# EAGLE design breakout v1.1 (EAGLE 7.2.0)
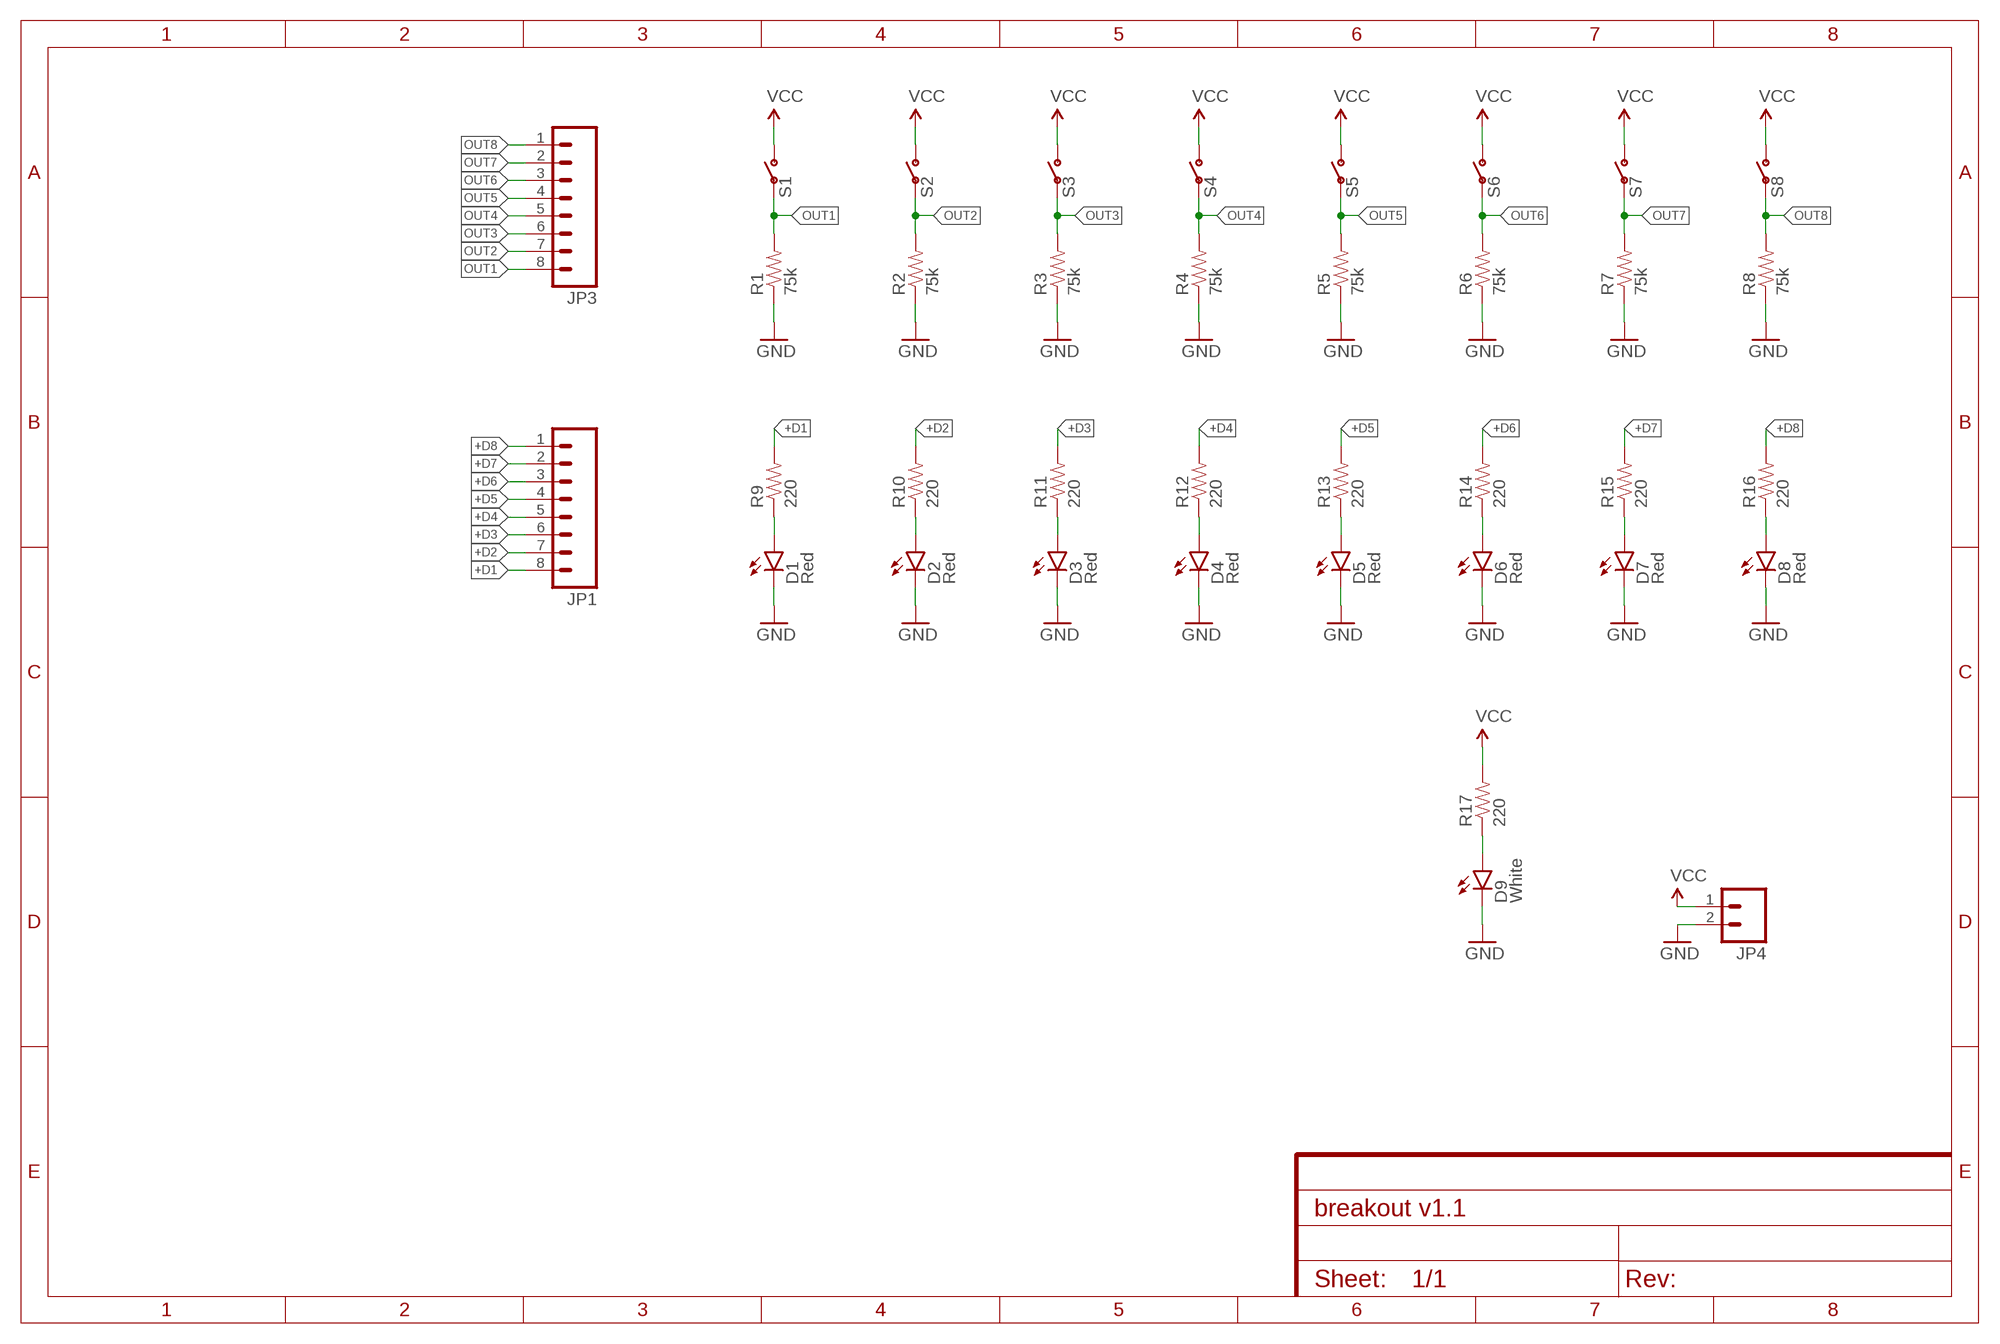
[diagram p0: schematic, sheet 1]

## Parts
D1  Red  LED0805  [0805]
D2  Red  LED0805  [0805]
D3  Red  LED0805  [0805]
D4  Red  LED0805  [0805]
D5  Red  LED0805  [0805]
D6  Red  LED0805  [0805]
D7  Red  LED0805  [0805]
D8  Red  LED0805  [0805]
D9  White  LED0603  [LED-0603]
JP1  M08  [1X08_ROUND]
JP3  M08  [1X08_ROUND]
JP4  M02PTH  [1X02]
R1  75k  RESISTOR0805-RES  [0805]
R2  75k  RESISTOR0805-RES  [0805]
R3  75k  RESISTOR0805-RES  [0805]
R4  75k  RESISTOR0805-RES  [0805]
R5  75k  RESISTOR0805-RES  [0805]
R6  75k  RESISTOR0805-RES  [0805]
R7  75k  RESISTOR0805-RES  [0805]
R8  75k  RESISTOR0805-RES  [0805]
R9  220  RESISTOR0805-RES  [0805]
R10  220  RESISTOR0805-RES  [0805]
R11  220  RESISTOR0805-RES  [0805]
R12  220  RESISTOR0805-RES  [0805]
R13  220  RESISTOR0805-RES  [0805]
R14  220  RESISTOR0805-RES  [0805]
R15  220  RESISTOR0805-RES  [0805]
R16  220  RESISTOR0805-RES  [0805]
R17  220  RESISTOR0805-RES  [0805]
S1  SWITCH_SPSTSMD  [5.2X5.2X1.5-SMD]
S2  SWITCH_SPSTSMD  [5.2X5.2X1.5-SMD]
S3  SWITCH_SPSTSMD  [5.2X5.2X1.5-SMD]
S4  SWITCH_SPSTSMD  [5.2X5.2X1.5-SMD]
S5  SWITCH_SPSTSMD  [5.2X5.2X1.5-SMD]
S6  SWITCH_SPSTSMD  [5.2X5.2X1.5-SMD]
S7  SWITCH_SPSTSMD  [5.2X5.2X1.5-SMD]
S8  SWITCH_SPSTSMD  [5.2X5.2X1.5-SMD]

## Nets
+D1: JP1.8 R9.2
+D2: JP1.7 R10.2
+D3: JP1.6 R11.2
+D4: JP1.5 R12.2
+D5: JP1.4 R13.2
+D6: JP1.3 R14.2
+D7: JP1.2 R15.2
+D8: JP1.1 R16.2
GND: D1.2(C) D2.2(C) D3.2(C) D4.2(C) D5.2(C) D6.2(C) D7.2(C) D8.2(C) D9.C JP4.2 R1.1 R2.1 R3.1 R4.1 R5.1 R6.1 R7.1 R8.1
N$1: D1.1(A) R9.1
N$2: D2.1(A) R10.1
N$3: D3.1(A) R11.1
N$4: D4.1(A) R12.1
N$5: D5.1(A) R13.1
N$6: D6.1(A) R14.1
N$7: D7.1(A) R15.1
N$8: D8.1(A) R16.1
N$9: D9.A R17.1
OUT1: JP3.8 R1.2 S1.P$3
OUT2: JP3.7 R2.2 S2.P$3
OUT3: JP3.6 R3.2 S3.P$3
OUT4: JP3.5 R4.2 S4.P$3
OUT5: JP3.4 R5.2 S5.P$3
OUT6: JP3.3 R6.2 S6.P$3
OUT7: JP3.2 R7.2 S7.P$3
OUT8: JP3.1 R8.2 S8.P$3
VCC: JP4.1 R17.2 S1.P$1 S2.P$1 S3.P$1 S4.P$1 S5.P$1 S6.P$1 S7.P$1 S8.P$1

## Library data of the parts
D1-D9 = Charlie-LED:LED: LEDs Standard schematic elements and footprints for 5mm, 3mm, 1206, and 0603 sized LEDs.
JP1 JP3 = SparkFun-Connectors:M08: Header 8 Standard 8-pin 0.1" header. Use with straight break away headers (SKU : PRT-00116), right angle break away headers (PRT-00553), swiss pins (PRT-00743), machine pins (PRT-00117), and female headers (PRT-00115).
JP4 = SparkFun-Connectors:M02: Standard 2-pin 0.1" header. Use with - straight break away headers ( PRT-00116) - right angle break away headers (PRT-00553) - swiss pins (PRT-00743) - machine pins (PRT-00117) - female headers (PRT-00115) Molex polarized connector foot print use with: PRT-08233 with associated crimp pins and housings. 2.54_SCREWTERM for use with PRT-10571. 3.5mm Screw Terminal footprints for PRT-08084 5mm Screw Terminal footprints for use with PRT-08432
R1-R17 = Charlie-Resistances:RESISTOR: Resistor Basic schematic elements and footprints for 0603, 1206, and PTH resistors.
S1-S8 = Charlie-Switch:SWITCH_SPST

## Board
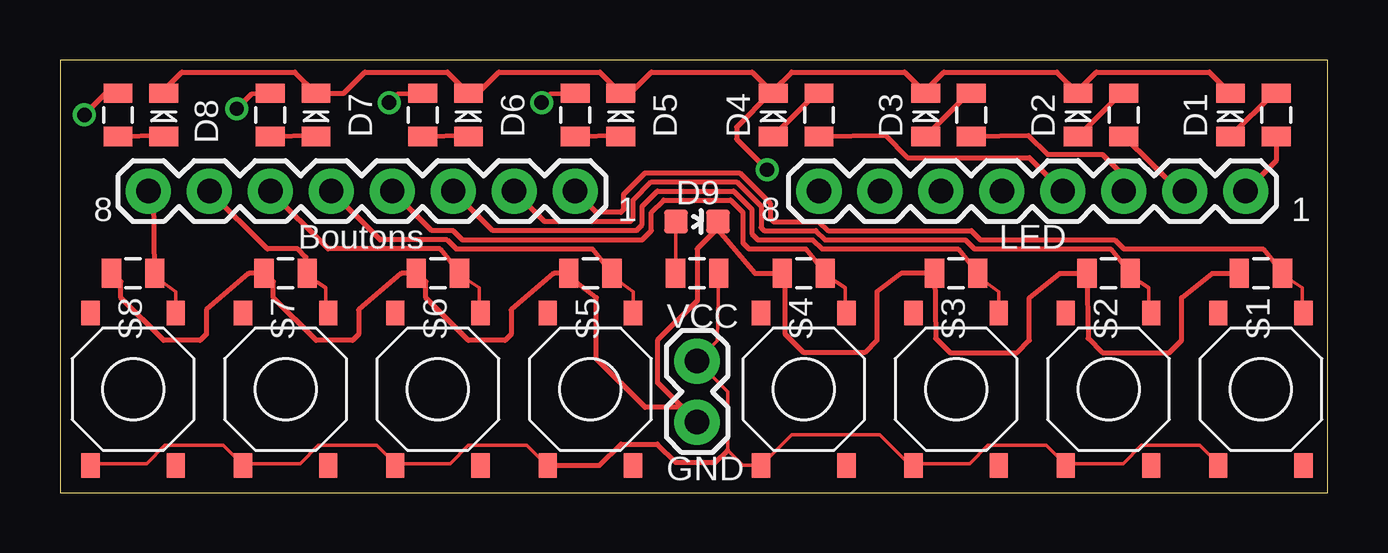
[diagram p1: board, top side]
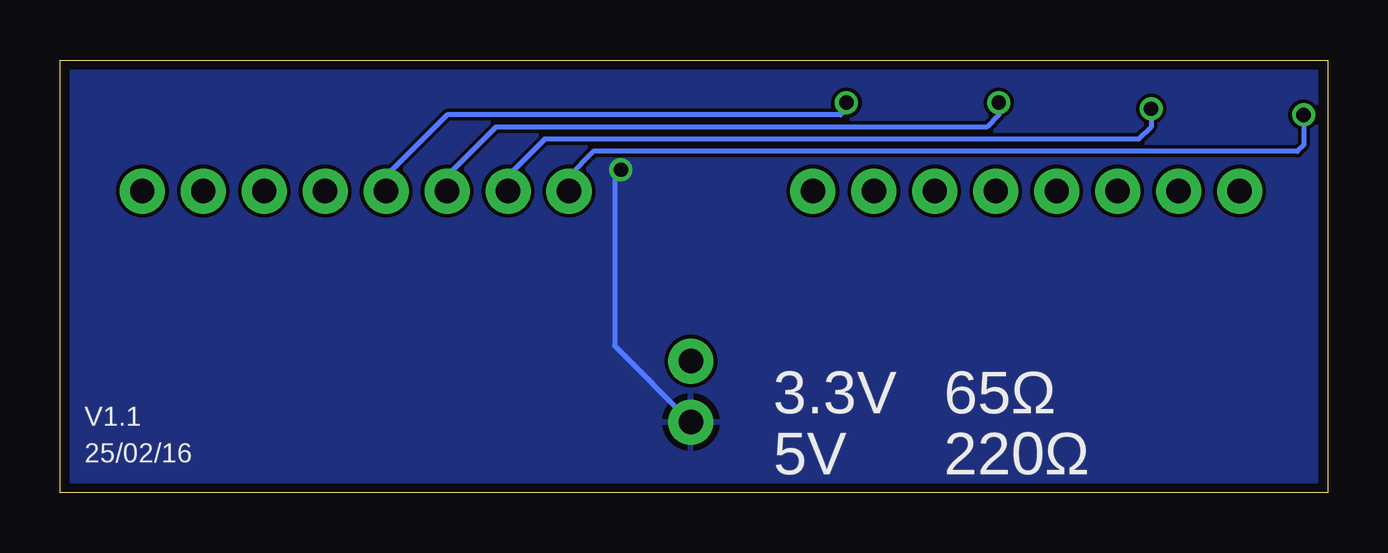
[diagram p2: board, bottom side, seen from below]

Size 52.83 x 18.03 mm. Coordinates in mm from the lower left corner, seen from the top.
Outline: 52.83,0 52.83,18.03 0,18.03 0,0 52.83,0
Copper layers (1*16): Top 0.0356mm / dielectric 1.5011mm / Bottom 0.0356mm
Design rules "LaenPCBOrder": minimum track width 6mil, minimum drill 13mil, track to track 6mil, track to pad 6mil, pad to pad 6mil, via to via 6mil, smd to smd 6mil, copper to edge 15mil, drill to drill 6mil, minimum pad ring 7mil, minimum via ring 7mil, stop-mask expansion 3mil, vias tented up to drill 0mil, thermal gap 10mil

### Footprints (pad centres in the part's own frame; a part is rotated, then mirrored left to right if it is on the bottom)
0805 = smd 0.8 x 1.2: 1 -0.9,0; 2 0.9,0
LED-0603 = smd 1 x 1: A 0,-0.877; C 0,0.877
1X08_ROUND = drill 1.016 pad 1.88: 1 0,0; 2 2.54,0; 3 5.08,0; 4 7.62,0; 5 10.16,0; 6 12.7,0; 7 15.24,0; 8 17.78,0
1X02 = drill 1.016 pad 1.88: 1 0,0; 2 2.54,0
5.2X5.2X1.5-SMD = smd 1.016 x 0.762: P$1 -3.175,1.778; P$2 3.175,1.778; P$3 3.175,-1.778; P$4 -3.175,-1.778

### Placement (x,y rotation side)
D1  48.77,15.75 90 top
D2  42.42,15.75 90 top
D3  36.07,15.75 90 top
D4  29.72,15.75 90 top
D5  23.37,15.75 90 top
D6  17.02,15.75 90 top
D7  10.67,15.75 90 top
D8  4.32,15.75 90 top
D9  26.54,11.3 270 top
JP1  31.62,12.57 0 top
JP3  3.68,12.57 0 top
JP4  26.54,5.49 270 top
R1  50.04,9.14 0 top
R2  43.69,9.14 0 top
R3  37.34,9.14 0 top
R4  30.99,9.14 0 top
R5  22.1,9.14 0 top
R6  15.75,9.14 0 top
R7  9.4,9.14 0 top
R8  3.05,9.14 0 top
R9  50.67,15.75 270 top
R10  44.32,15.75 270 top
R11  37.97,15.75 270 top
R12  31.62,15.75 270 top
R13  21.46,15.75 90 top
R14  15.11,15.75 90 top
R15  8.76,15.75 90 top
R16  2.41,15.75 90 top
R17  26.54,9.14 0 top
S1  50.04,4.32 90 top
S2  43.69,4.32 90 top
S3  37.34,4.32 90 top
S4  30.99,4.32 90 top
S5  22.1,4.32 90 top
S6  15.75,4.32 90 top
S7  9.4,4.32 90 top
S8  3.05,4.32 90 top

### Tracks (layer width: path | path; a pad name or v marks a point on that pad's centre or on a via)
+D1
  Top 0.203: R9.2 50.67,13.84 JP1.8
+D2
  Top 0.203: R10.2 46.65,12.57 JP1.7
+D3
  Top 0.203: R11.2 40.35,14.9 41.15,14.1 43.43,14.1 44.32,13.21 JP1.6
+D4
  Top 0.203: R12.2 34.38,14.9 35.31,13.97 40.39,13.97 JP1.5
+D5  (via drill 0.6)
  Top 0.203: R13.2 20.41,16.6 v20.07,16.26
  Bottom 0.203: v20.07,16.26 20.07,16 20.32,15.75 36.7,15.75 39.24,13.21 JP1.4
+D6  (via drill 0.6)
  Top 0.203: R14.2 14.06,16.6 v13.72,16.26
  Bottom 0.203: v13.72,16.26 13.72,15.75 14.22,15.24 34.67,15.24 36.7,13.21 JP1.3
+D7  (via drill 0.6)
  Top 0.203: R15.2 7.96,16.6 v7.37,16
  Bottom 0.203: v7.37,16 7.37,15.24 7.87,14.73 32.64,14.73 34.16,13.21 JP1.2
+D8  (via drill 0.6)
  Top 0.203: R16.2 1.87,16.6 v1.02,15.75
  Bottom 0.203: v1.02,15.75 1.02,14.48 1.27,14.22 30.61,14.22 31.62,13.21 JP1.1
GND  (via drill 0.6)
  Top 0.203: R8.1 2.54,8.8 2.54,8.13 4.32,6.35 5.84,6.35 6.1,6.6 6.1,7.62 7.87,9.14 R7.1 8.89,8.8 8.89,8.13 10.67,6.35 12.19,6.35 12.45,6.6 12.45,7.62 14.22,9.14 R6.1 15.24,8.8 15.24,8.13 17.02,6.35 18.54,6.35 18.8,6.6 18.8,7.62 20.57,9.14 R5.1 21.25,8.98 22.35,8.13 22.35,5.59 24.38,3.56 25.93,3.56 JP4.2 24.92,4.57 24.89,4.57 24.89,6.35 26.54,8 26.54,10.16 27.42,11.04 | D9.C 27.42,11.04 | 27.42,11.04 27.42,10.93 28.96,9.14 R4.1 30.23,9.06 30.23,6.6 30.99,5.84 33.53,5.84 34.04,6.35 34.04,8.38 35.05,9.14 R3.1 36.49,6.44 37.08,5.84 39.88,5.84 40.39,6.35 40.39,8.13 41.66,9.14 R2.1 42.84,6.44 43.43,5.84 46.23,5.84 46.74,6.35 46.74,8.13 48.01,9.14 R1.1 | D8.2 4.32,16.76 5.08,17.53 9.79,17.53 D7.2 11.82,16.65 12.7,17.53 16.14,17.53 D6.2 17.41,16.65 18.29,17.53 22.49,17.53 D5.2 23.76,16.65 24.64,17.53 28.84,17.53 D4.2 | D4.2 29.72,16.76 30.48,17.53 35.19,17.53 D3.2 36.07,16.76 36.83,17.53 41.54,17.53 D2.2 42.42,16.76 43.18,17.53 47.89,17.53 D1.2 | D4.2 29.6,16.65 28.19,15.24 28.19,14.73 v29.46,13.46
  Bottom 0.203: 29.72,13.21 29.72,6.12 JP4.2
  pour Bottom (isolate 0.127): 0,18.03 52.83,18.03 52.83,0 0,0
N$1
  Top 0.203: R9.1 50.62,16.65 50.57,16.65 D1.1
N$2
  Top 0.203: R10.1 44.27,16.65 44.22,16.65 D2.1
N$3
  Top 0.203: R11.1 37.92,16.65 37.87,16.65 D3.1
N$4
  Top 0.203: R12.1 31.57,16.65 31.52,16.65 D4.1
N$5
  Top 0.203: R13.1 23.32,14.9 D5.1
N$6
  Top 0.203: R14.1 16.97,14.9 D6.1
N$7
  Top 0.203: R15.1 10.62,14.9 D7.1
N$8
  Top 0.203: R16.1 4.27,14.9 D8.1
N$9
  Top 0.152: R17.1 25.67,9.17 D9.A
OUT1
  Top 0.152: S1.P$3 51.77,7.62 51.77,8.53 51,9.04 R1.2
  Top 0.203: R1.2 50.13,10.16 44.32,10.16 43.94,10.54 38.35,10.54 37.97,10.92 32,10.92 31.62,11.3 29.72,11.3 29.59,11.43 29.59,12.06 28.32,13.33 24.38,13.33 23.49,12.45 23.49,11.81 23.37,11.68 22.35,11.68 JP3.8
OUT2
  Top 0.152: S2.P$3 45.36,7.62 45.36,8.53 44.6,9.04 R2.2
  Top 0.203: R2.2 43.78,10.16 38.1,10.16 37.72,10.54 31.88,10.54 31.5,10.92 29.34,10.92 29.21,11.05 29.21,11.94 28.19,12.95 24.64,12.95 23.88,12.19 23.88,11.43 23.75,11.3 20.19,11.3 JP3.7
OUT3
  Top 0.152: S3.P$3 39.12,8.38 38.2,9.04 R3.2
  Top 0.203: R3.2 37.43,10.16 31.75,10.16 31.37,10.54 29.08,10.54 28.83,10.79 28.83,11.81 28.07,12.57 24.89,12.57 24.26,11.94 24.26,11.18 24,10.92 18.03,10.92 JP3.6
OUT4
  Top 0.152: S4.P$3 32.71,7.62 32.71,8.53 31.95,9.04 R4.2
  Top 0.203: R4.2 31.08,10.16 28.7,10.16 28.45,10.41 28.45,11.68 27.94,12.19 25.15,12.19 24.64,11.68 24.64,10.92 24.26,10.54 16.76,10.54 16.38,10.92 15.49,10.92 JP3.5
OUT5
  Top 0.152: S5.P$3 23.88,8.38 22.96,9.04 R5.2
  Top 0.203: R5.2 22.19,10.16 16.51,10.16 16.13,10.54 13.33,10.54 JP3.4
OUT6
  Top 0.152: S6.P$3 17.48,7.62 17.48,8.53 16.71,9.04 R6.2
  Top 0.203: R6.2 15.84,10.16 11.18,10.16 JP3.3
OUT7
  Top 0.152: S7.P$3 11.07,7.62 11.07,8.53 10.31,9.04 R7.2
  Top 0.203: R7.2 10.25,9.82 9.91,10.16 8.64,10.16 JP3.2
OUT8
  Top 0.152: S8.P$3 4.83,8.38 3.91,9.04 R8.2
  Top 0.203: R8.2 3.9,12.36 JP3.1
VCC
  Top 0.152: S8.P$1 1.32,1.22 3.61,1.22 4.37,1.98 6.81,1.98 7.57,1.22 S7.P$1 7.72,1.22 10.01,1.22 10.77,1.98 13.21,1.98 13.97,1.22 | 13.97,1.22 16.26,1.22 17.02,1.98 19.46,1.98 20.22,1.22 S5.P$1 | 13.97,1.22 S6.P$1 | S1.P$1 48.26,1.22 47.5,1.98 45.06,1.98 44.3,1.22 42.01,1.22 S2.P$1 41.86,1.22 41.1,1.98 38.66,1.98 37.9,1.22 35.61,1.22 S3.P$1 35.43,1.14 34.16,2.41 30.48,2.41 S4.P$1 28.45,1.14 27.81,1.78 27.81,4.22 JP4.1 27.39,6.34 R17.2
  Top 0.203: S5.P$1 22.48,1.14 23.37,2.03 24.89,2.03 25.65,1.27 27.3,1.27 27.81,1.78

### Text on the board
tPlace: 8 | 1 | 8 | 1 | Boutons | LED | VCC | GND
bPlace: 65Ω | 3.3V | V1.1 | 25/02/16 | 220Ω | 5V